# EAGLE design power-distribution_soccer-robot-2 (EAGLE 9.6.2)
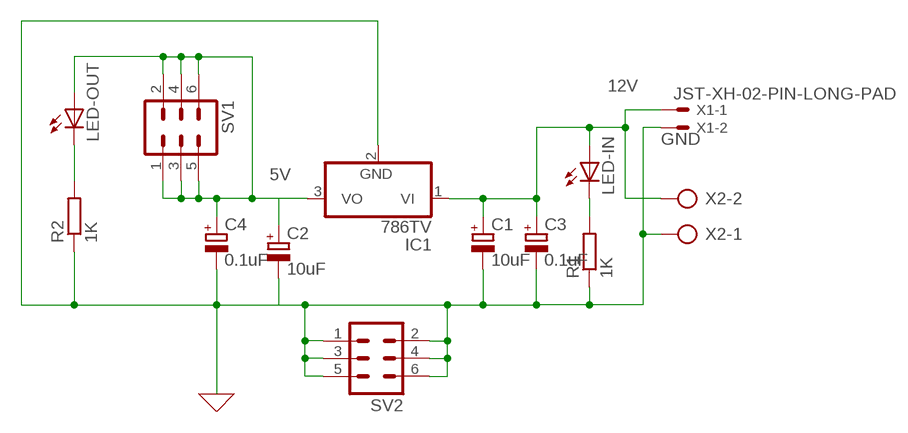
[diagram p0: schematic, sheet 1]

## Parts
C1  10uF  CPOL-EUE2,5-6E  [E2,5-6E]
C2  10uF  CPOL-EUE2,5-6E  [E2,5-6E]
C3  0.1uF  CPOL-EUE2,5-6E  [E2,5-6E]
C4  0.1uF  CPOL-EUE2,5-6E  [E2,5-6E]
IC1  786TV  [TO220V]
LED-IN  LED5MM  [LED5MM]
LED-OUT  LED5MM  [LED5MM]
R1  1K  R-EU_0204/5  [0204/5]
R2  1K  R-EU_0204/5  [0204/5]
SV1  MA03-2  [MA03-2(2)]
SV2  MA03-2  [MA03-2(2)]
X1  JST-XH-02-PIN-LONG-PAD  [JST-XH-02-PACKAGE-LONG-PAD]
X2  AK500/2-H  [AK500/2-H]

## Nets
5V: C2.+ C4.+ IC1.3(VO) LED-OUT.A SV1.1 SV1.2 SV1.3 SV1.4 SV1.5 SV1.6
12V: C1.+ C3.+ IC1.1(VI) LED-IN.A X1.1 X2.2
GND: C1.- C2.- C3.- C4.- IC1.2(GND) R1.1 R2.1 SV2.1 SV2.2 SV2.3 SV2.4 SV2.5 SV2.6 X1.2 X2.1
N$1: LED-OUT.K(C) R2.2
N$2: LED-IN.K(C) R1.2

## Library data of the parts
C1-C4 = rcl:CPOL-EU: POLARIZED CAPACITOR, European symbol
IC1 = linear:78*: Positive VOLTAGE REGULATOR Source: http://cache.national.com/ds/LM/LM78L05.pdf http://www.fairchildsemi.com/ds/LM/LM7805.pdf
LED-IN LED-OUT = led:LED: LED OSRAM: - CHIPLED LG R971, LG N971, LY N971, LG Q971, LY Q971, LO R971, LY R971 LH N974, LH R974 LS Q976, LO Q976, LY Q976 LO Q996 - Hyper CHIPLED LW Q18S LB Q993, LB Q99A, LB R99A - SideLED LS A670, LO A670, LY A670, LG A670, LP A670 LB A673, LV A673, LT A673, LW A673 LH A674 LY A675 LS A676, LA A676, LO A676, LY A676, LW A676 LS A679, LY A679, LG A679 - Hyper Micro SIDELED® LS Y876, LA Y876, LO Y876, LY Y876 LT Y87S - SmartLED LW L88C, LW L88S LB L89C, LB L89S, LG L890 LS L89K, LO L89K, LY L89K LS L896, LA L896, LO L896, LY L896 - TOPLED LS T670, LO T670, LY T670, LG T670, LP T670 LSG T670, LSP T670, LSY T670, LOP T670, LYG T670 LG T671, LOG T671, LSG T671 LB T673, LV T673, LT T673, LW T673 LH T674 LS T676, LA T676, LO T676, LY T676, LB T676, LH T676, LSB T676, LW T676 LB T67C, LV T67C, LT T67C, LS T67K, LO T67K, LY T67K, LW E67C LS E67B, LA E67B, LO E67B, LY E67B, LB E67C, LV E67C, LT E67C LW T67C LS T679, LY T679, LG T679 LS T770, LO T770, LY T770, LG T770, LP T770 LB T773, LV T773, LT T773, LW T773 LH T774 LS E675, LA E675, LY E675, LS T675 LS T776, LA T776, LO T776, LY T776, LB T776 LHGB T686 LT T68C, LB T68C - Hyper Mini TOPLED® LB M676 - Mini TOPLED Santana® LG M470 LS M47K, LO M47K, LY M47K Source: http://www.osram.convergy.de LUXEON: - LUMILED® LXK2-PW12-R00, LXK2-PW12-S00, LXK2-PW14-U00, LXK2-PW14-V00 LXK2-PM12-R00, LXK2-PM12-S00, LXK2-PM14-U00 LXK2-PE12-Q00, LXK2-PE12-R00, LXK2-PE12-S00, LXK2-PE14-T00, LXK2-PE14-U00 LXK2-PB12-K00, LXK2-PB12-L00, LXK2-PB12-M00, LXK2-PB14-N00, LXK2-PB14-P00, LXK2-PB14-Q00 LXK2-PR12-L00, LXK2-PR12-M00, LXK2-PR14-Q00, LXK2-PR14-R00 LXK2-PD12-Q00, LXK2-PD12-R00, LXK2-PD12-S00 LXK2-PH12-R00, LXK2-PH12-S00 LXK2-PL12-P00, LXK2-PL12-Q00, LXK2-PL12-R00 Source: www.luxeon.com KINGBRIGHT: KA-3528ASYC Source: www.kingbright.com
R1 R2 = rcl:R-EU_: RESISTOR, European symbol
SV1 SV2 = con-lstb:MA03-2: PIN HEADER; OC_FARNELL: unknown; OC_NEWARK: unknown
X1 = Rembrandt Electronics - JST XH Connectors v1-0:JST-XH-02-PIN: JST XH Connector 2 Pin Wire to board connector. Pitch: 2,54 mm, (0.100") Number of pins: 2 Created by Rembrandt Electronics www.rembrandtelectronics.com
X2 = con-ptr500:AK500/2-H: CONNECTOR Aug. 2004 / PTR Meßtechnik: Die Bezeichnung der Serie AK505 wurde geändert. Es handelt sich hierbei um AK500 in horizontaler Ausführung.; OC_FARNELL: unknown; OC_NEWARK: unknown

## Board
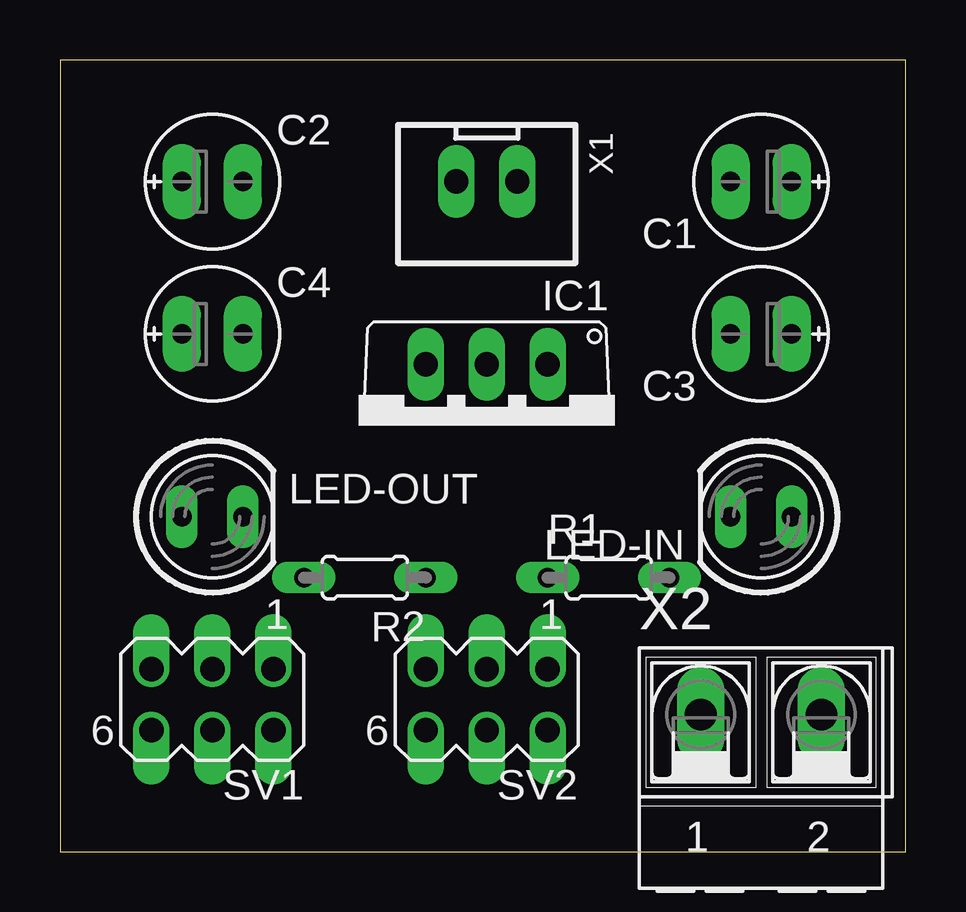
[diagram p1: board, top side]
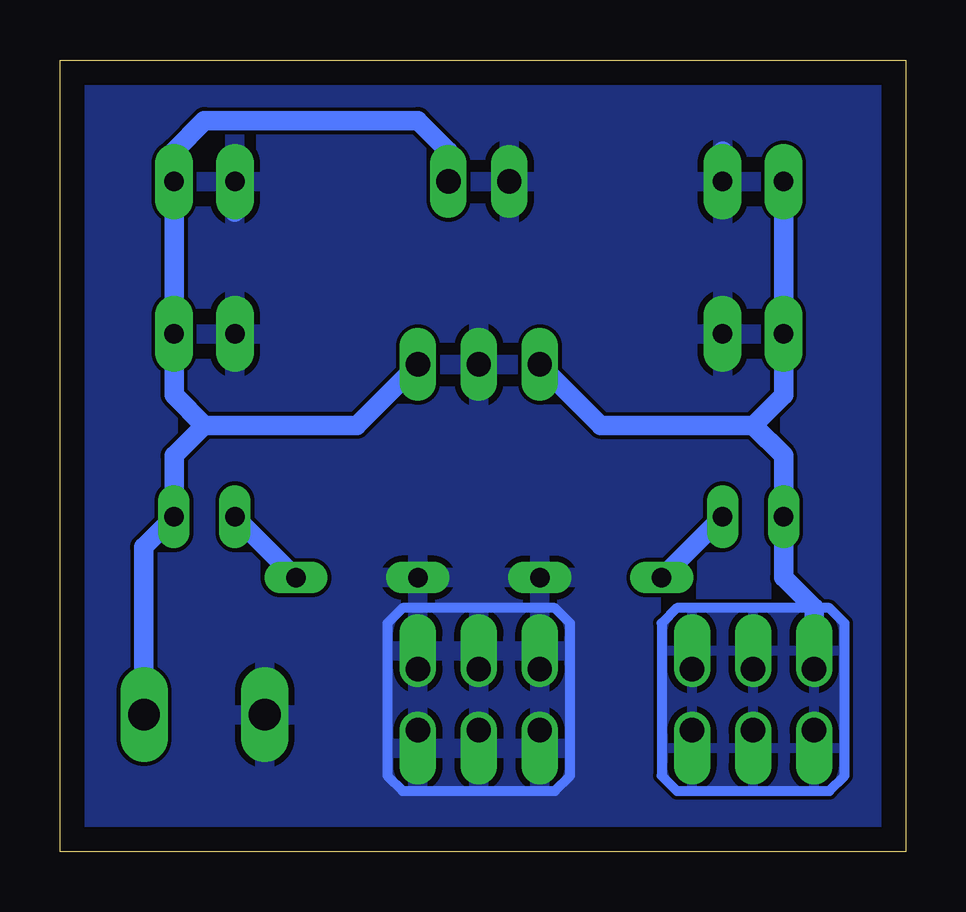
[diagram p2: board, bottom side, seen from below]

Size 35.23 x 33.01 mm. Coordinates in mm from the lower left corner, seen from the top.
Outline: 0,0 35.23,0 35.23,33.01 0,33.01 0,0
Copper layers (1*16): Top 0.035mm / dielectric 1.5mm / Bottom 0.035mm
Design rules "default": minimum track width 6mil, minimum drill 0.35mm, track to track 6mil, track to pad 6mil, pad to pad 6mil, via to via 6mil, smd to smd 6mil, copper to edge 40mil, drill to drill 6mil, minimum pad ring 10mil, minimum via ring 8mil, stop-mask expansion 4mil, vias tented up to drill 0mil, thermal gap 10mil

### Footprints (pad centres in the part's own frame; a part is rotated, then mirrored left to right if it is on the bottom)
E2,5-6E = drill 0.813 pad 1.575 long: + -1.27,0; - 1.27,0
TO220V = drill 1.016 long: 1 -2.54,-2.54; 2 0,-2.54; 3 2.54,-2.54
LED5MM = drill 0.813 long: A -1.27,0; K 1.27,0
0204/5 = drill 0.813 long: 1 -2.54,0; 2 2.54,0
MA03-2(2) = drill 1.016 offset: 1 -2.54,-1.27; 2 -2.54,1.27; 3 0,-1.27; 4 0,1.27; 5 2.54,-1.27; 6 2.54,1.27
JST-XH-02-PACKAGE-LONG-PAD = drill 1.016 long: 1 -1.27,0; 2 1.27,0
AK500/2-H = drill 1.321 long: 1 -2.515,0; 2 2.515,0

### Placement (x,y rotation side)
C1  29.21,27.94 180 top
C2  6.35,27.94 0 top
C3  29.21,21.59 180 top
C4  6.35,21.59 0 top
IC1  17.78,17.78 180 top
LED-IN  29.21,13.97 180 top
LED-OUT  6.35,13.97 0 top
R1  22.86,11.43 0 top
R2  12.7,11.43 180 top
SV1  6.35,6.35 180 top
SV2  17.78,6.35 180 top
X1  17.78,27.94 180 top
X2  29.21,5.72 0 top

### Tracks (layer width: path | path; a pad name or v marks a point on that pad's centre or on a via)
5V
  Bottom 0.406: 2.54,3.17 2.54,9.52 3.18,10.16 3.81,10.16 9.52,10.16 10.16,9.52 10.16,3.17 9.52,2.54 3.18,2.54 2.54,3.17
  Bottom 0.813: C2.+ C4.+ 5.08,19.05 6.35,17.78 | IC1.3 12.7,17.78 6.35,17.78 | 6.35,17.78 5.08,16.51 LED-OUT.A 5.08,11.43 3.81,10.16 SV1.5
  pour Bottom: 2.54,9.52 3.18,10.16 9.52,10.16 10.16,9.52 10.16,3.17 9.52,2.54 3.18,2.54 2.54,3.17
12V
  Bottom 0.813: X1.1 19.05,29.21 20.32,30.48 29.21,30.48 30.48,29.21 C1.+ C3.+ 30.48,19.05 29.21,17.78 | IC1.1 22.86,17.78 29.21,17.78 | 29.21,17.78 30.48,16.51 LED-IN.A 31.75,12.7 31.75,5.69 X2.2
GND
  Bottom 0.406: 13.97,9.52 14.61,10.16 20.95,10.16 21.59,9.52 21.59,3.17 20.95,2.54 14.61,2.54 13.97,3.17 13.97,9.52
  Bottom 0.813: 27.94,26.67 C1.- | 7.62,29.21 C2.-
  pour Bottom: 0,31.75 1.27,33.02 34.29,33.02 35.56,31.75 35.56,1.27 34.29,0 1.27,0 0,1.27
  pour Bottom: 13.97,9.52 14.61,10.16 20.95,10.16 21.59,9.52 21.59,3.17 20.95,2.54 14.61,2.54 13.97,3.17
N$1
  Bottom 0.813: R2.2 LED-OUT.K
N$2
  Bottom 0.813: R1.2 LED-IN.K